# Altium schematic sheet TopHierarchy.SchDoc
size A3
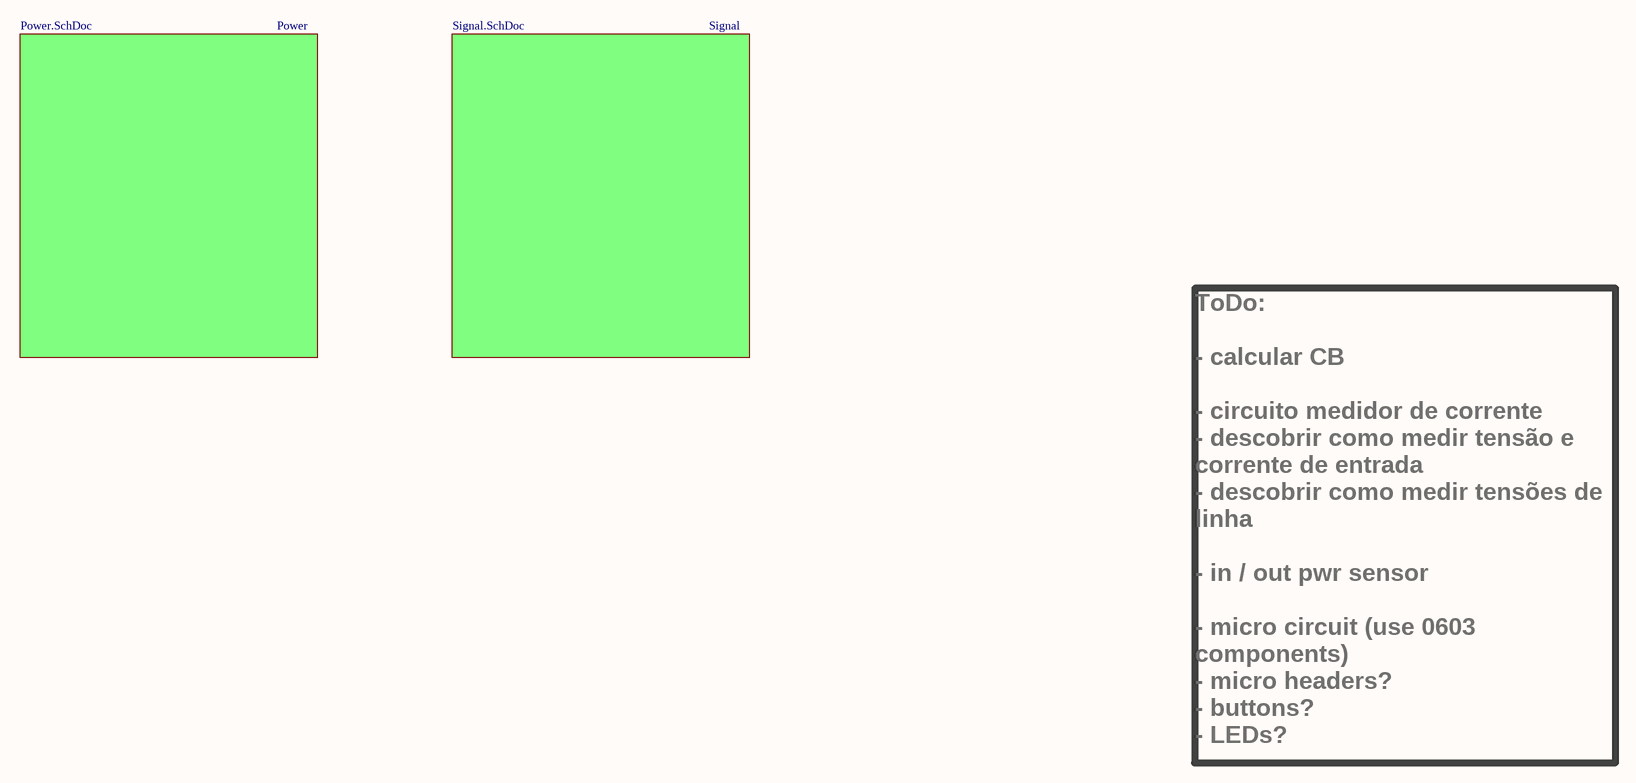
[diagram p0: TopHierarchy.SchDoc]

## Sub-sheets
Power = Power.SchDoc: no entries
Signal = Signal.SchDoc: no entries

## Notes on the sheet
- ToDo:
  - calcular CB
  - circuito medidor de corrente
  - descobrir como medir tensão e corrente de entrada
  - descobrir como medir tensões de linha
  - in / out pwr sensor
  - micro circuit (use 0603 components)
  - micro headers?
  - buttons?
  - LEDs?
  - in / out connectors
  - choose heat sink